# Altium project PCB_Project.PrjPcb
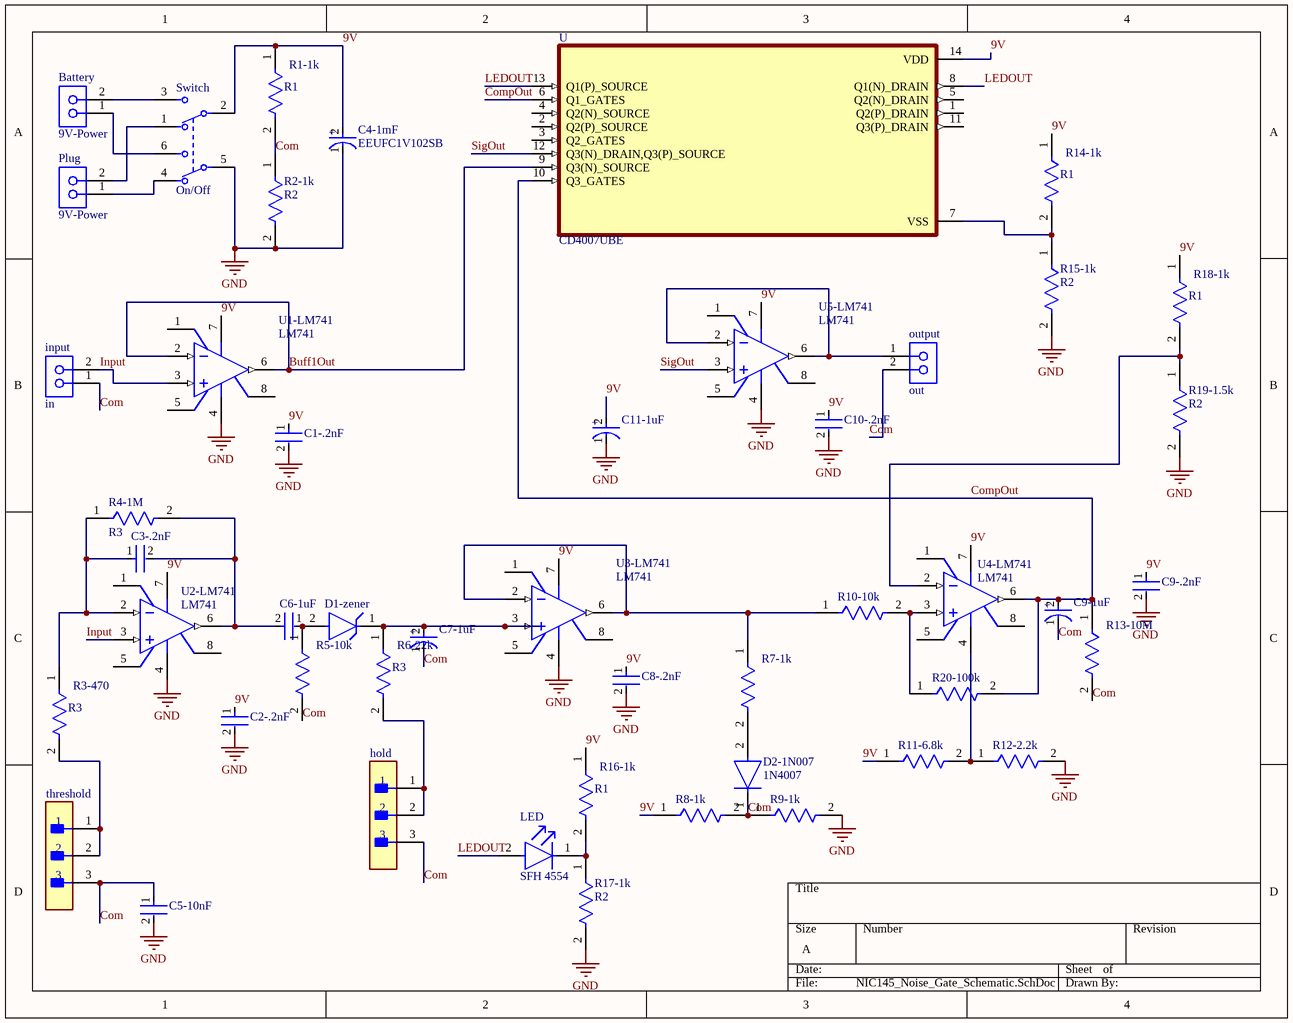
[diagram p0: NIC145_Noise_Gate_Schematic.SchDoc]
1 sheet, 48 parts. Net scope: global (net labels, ports and power ports of the same name join across sheets).
Board file: Noise_Gate_PCB.PcbDoc

## Sheet NIC145_Noise_Gate_Schematic.SchDoc
size A; SheetNumber: 1; SheetTotal: 1

### Parts
Battery  9V-Power  [SMTC-SSW-102-02-X-S]
C1-.2nF  (no value)  [FP-565R30GASS33-MFG]
C2-.2nF  (no value)  [FP-565R30GASS33-MFG]
C3-.2nF  (no value)  [FP-565R30GASS33-MFG]
C4-1mF  EEUFC1V102SB  [FP-RAD-TH-D_16_0_5-L_20_2-MFG]
C5-10nF  ECWF4754JL  [FP-ECWF4754JL-MFG]  (value not drawn)
C6-1uF  PHE844RR7100MR06L2  [FP-PHE844RR7100MR06L2-MFG]  (value not drawn)
C7-1uF  ECA-2CHG010I  [FP-ECA-2CHG010I-MFG]  (value not drawn)
C8-.2nF  (no value)  [FP-565R30GASS33-MFG]
C9-1uF  ECA-2CHG010I  [FP-ECA-2CHG010I-MFG]  (value not drawn)
C9-.2nF  (no value)  [FP-565R30GASS33-MFG]
C10-.2nF  (no value)  [FP-565R30GASS33-MFG]
C11-1uF  ECA-2CHG010I  [FP-ECA-2CHG010I-MFG]  (value not drawn)
D1-zener  1N5242BTR  [FP-017AG-MFG]  (value not drawn)
D2-1N007  1N4007  [FP-1N4007-MFG]
hold  (no value)  [FP-641966-1-MFG]
input  in  [SMTC-SSW-102-02-X-S]
LED  SFH 4554  [FP-SFH_4554-MFG]
output  out  [SMTC-SSW-102-02-X-S]
Plug  9V-Power  [SMTC-SSW-102-02-X-S]
R1-1k  R1  [FP-MRS25-MFG]
R2-1k  R2  [FP-MRS25-MFG]
R3-470  R3  [FP-MRS25-MFG]
R4-1M  R3  [FP-MRS25-MFG]
R5-10k  R3  [FP-MRS25-MFG]  (value not drawn)
R6-22k  R3  [FP-MRS25-MFG]
R7-1k  R3  [FP-MRS25-MFG]  (value not drawn)
R8-1k  R1  [FP-MRS25-MFG]  (value not drawn)
R9-1k  R2  [FP-MRS25-MFG]  (value not drawn)
R10-10k  R2  [FP-MRS25-MFG]  (value not drawn)
R11-6.8k  R1  [FP-MRS25-MFG]  (value not drawn)
R12-2.2k  R2  [FP-MRS25-MFG]  (value not drawn)
R13-10M  R3  [FP-MRS25-MFG]  (value not drawn)
R14-1k  R1  [FP-MRS25-MFG]
R15-1k  R2  [FP-MRS25-MFG]
R16-1k  R1  [FP-MRS25-MFG]
R17-1k  R2  [FP-MRS25-MFG]
R18-1k  R1  [FP-MRS25-MFG]
R19-1.5k  R2  [FP-MRS25-MFG]
R20-100k  R2  [FP-MRS25-MFG]  (value not drawn)
Switch  On/Off  [FP-100DP1T2B3M2QEH-MFG]
threshold  (no value)  [FP-641966-1-MFG]
U  CD4007UBE  [DIP794W45P254L1969H508Q14]
U1-LM741  LM741  [P0008A]
U2-LM741  LM741  [P0008A]
U3-LM741  LM741  [P0008A]
U4-LM741  LM741  [P0008A]
U5-LM741  LM741  [P0008A]

### Nets
GND: C1-.2nF.2 C2-.2nF.2 C4-1mF.1(C) C5-10nF.2 C8-.2nF.2 C9-.2nF.2 C10-.2nF.2 C11-1uF.1(C) R2-1k.2 R9-1k.2 R12-2.2k.2 R15-1k.2 R17-1k.2 R19-1.5k.2 Switch.5 U1-LM741.4(V-) U2-LM741.4(V-) U3-LM741.4(V-) U5-LM741.4(V-)
9V: C1-.2nF.1 C2-.2nF.1 C4-1mF.2(A) C8-.2nF.1 C9-.2nF.1 C10-.2nF.1 C11-1uF.2(A) R1-1k.1 R8-1k.1 R11-6.8k.1 R14-1k.1 R16-1k.1 R18-1k.1 Switch.2 U.14(VDD) U1-LM741.7(V+) U2-LM741.7(V+) U3-LM741.7(V+) U4-LM741.7(V+) U5-LM741.7(V+)
Buff1Out: U.9(Q3(N)_SOURCE) U1-LM741.2(IN-) U1-LM741.6(OUT)
Com: C5-10nF.1 C7-1uF.1(C) C9-1uF.1(C) D2-1N007.1(C) hold.3 input.1 output.2 R1-1k.2 R2-1k.1 R5-10k.2 R8-1k.2 R9-1k.1 R13-10M.2 threshold.3
CompOut: C9-1uF.2(A) R13-10M.1 R20-100k.2 U.6(Q1_GATES) U.10(Q3_GATES) U4-LM741.6(OUT)
Input: input.2 U1-LM741.3(IN+) U2-LM741.3(IN+)
LEDOUT: LED.2(A) U.8(Q1(N)_DRAIN) U.13(Q1(P)_SOURCE)
SigOut: U.12(Q3(N)_DRAIN,Q3(P)_SOURCE) U5-LM741.3(IN+)
NetBattery_1: Battery.1 Switch.6
NetBattery_2: Battery.2 Switch.3
NetC3-.2nF_1: C3-.2nF.1 R3-470.1 R4-1M.1 U2-LM741.2(IN-)
NetC3-.2nF_2: C3-.2nF.2 C6-1uF.2 R4-1M.2 U2-LM741.6(OUT)
NetC6-1uF_1: C6-1uF.1 D1-zener.2(A) R5-10k.1
NetC7-1uF_2: C7-1uF.2(A) D1-zener.1(C) R6-22k.1 U3-LM741.3(IN+)
NetD2-1N007_2: D2-1N007.2(A) R7-1k.2
Nethold_1: hold.1 hold.2 R6-22k.2
NetLED_1: LED.1(C) R16-1k.2 R17-1k.1
Netoutput_1: output.1 U5-LM741.2(IN-) U5-LM741.6(OUT)
NetPlug_1: Plug.1 Switch.4
NetPlug_2: Plug.2 Switch.1
NetR3-470_2: R3-470.2 threshold.1 threshold.2
NetR7-1k_1: R7-1k.1 R10-10k.1 U3-LM741.2(IN-) U3-LM741.6(OUT)
NetR10-10k_2: R10-10k.2 R20-100k.1 U4-LM741.3(IN+)
NetR11-6.8k_2: R11-6.8k.2 R12-2.2k.1 U4-LM741.4(V-)
NetR14-1k_2: R14-1k.2 R15-1k.1 U.7(VSS)
NetR18-1k_2: R18-1k.2 R19-1.5k.1 U4-LM741.2(IN-)

Not connected (* = marked no-connect by the designer): U 1(Q2(P)_DRAIN) 2(Q2(P)_SOURCE) 3(Q2_GATES) 4(Q2(N)_SOURCE) 5(Q2(N)_DRAIN) 11(Q3(P)_DRAIN); U1-LM741 1(OFS_NULL) 5(OFS_NULL) 8(NC); U2-LM741 1(OFS_NULL) 5(OFS_NULL) 8(NC); U3-LM741 1(OFS_NULL) 5(OFS_NULL) 8(NC); U4-LM741 1(OFS_NULL) 5(OFS_NULL) 8(NC); U5-LM741 1(OFS_NULL) 5(OFS_NULL) 8(NC)

### Notes on the sheet
- (in symbol CMP-05427-002176-1) +
- (in symbol CMP-05427-002178-1) +

### Library data of the parts
Battery input output Plug = CMP-1023-00323-1: SQ Post Socket, Through-hole, Vertical, -55 to 105 degC, 2.54 mm Pitch, 2-Pin, Female, RoHS; Manufacturer: Samtec; PartNumber: SSW-102-02-T-S; Pitch: 2.54 mm; ComponentLink3Description: Package Specification; ComponentLink2Description: Datasheet; ComponentLink1Description: Manufacturer URL; PackageVersion: CA, 6/1987; DatasheetVersion: F-214; PackageDescription: Assembly, Socket Strip .016 X .031 Tail; ComponentLink2URL: http://www.samtec.com/documents/webfiles/pdf/SSW_TH.PDF; RoHS: True; ComponentLink3URL: http://www.samtec.com/documents/webfiles/cpdf/SSW-1XX-XX-XXX-X-XX-XXX-XX-MKT.pdf; ComponentLink1URL: http://www.samtec.com; PackageReference: SSW-102-02-X-S; Mounting Technology: Through-hole; Orientation: Vertical; Temperature Range: -55 to 105 degC
C1-.2nF C2-.2nF C3-.2nF C8-.2nF C9-.2nF C10-.2nF = CMP-00030-41968055-1: 565R30GASS33 33nF 3 kV dc Ceramic Single Layer Capacitor; Z5U Dielectric Radial 565R Series; Voltage: 3kV; Tolerance: 20%; Lead Diameter: 640µm; Diameter: 22.9mm; Lead Free: Lead Free; Material: Ceramic; Schedule B: 8532230060; Depth: 6.1mm; Mount: Radial; Max Operating Temperature: 105°C; Capacitance: 33nF; Composition: Ceramic; RoHS: Compliant; Min Operating Temperature: -25°C; Dielectric: Z5U; NexarPartId: 41968055; Height: 22.9mm; Voltage Rating: 3kV; Lead Pitch: 9.52mm; Termination: Radial; Packaging: Bulk; Case/Package: Radial; Voltage Rating (DC): 3kV
C4-1mF = CMP-05427-002178-1: Aluminum Electrolytic Capacitors (Radial Lead Type) AEC-Q200 Qualified 1000uF ±20% 35V; Polarity: Polar; Life (Hours): 5000Hour; ESR (Equivalent Series Resistance): 29mR; Ripple Current: 2.205A; Capacitance: 1mF; Lead Diameter: 0.8mm; Radiation Hardening: No; Lead Pitch: 7.5mm; Package Quantity: 250; Voltage Rating: 35V; Voltage Rating (DC): 35V; Ratings: AEC-Q200; Impedance: 29mR; Length: 20mm; Mount: Through Hole; Series: FC; Case/Package: Radial; Min Operating Temperature: -55°C; RoHS Compliant: Yes; Height: 20mm; Packaging: Tape and Reel; Contact Plating: Tin; Max Operating Temperature: 105°C; Height - Seated (Max): 1.063inch; Tolerance: 20%; Diameter: 16mm; Termination: Radial
C5-10nF = CMP-05434-000002-1: CAP FILM 0.75UF 5% 400VDC RADIAL; Manufacturer: Panasonic Electronic Components; Standoff Height: 1.5mm; Material: Plastic Film; Voltage Rating: 400V; Device Class L1: Passive Components; Device Class L2: Capacitors; ComponentLink2Description: Datasheet; Ipc Land Pattern Name: CAPAD1750W100L2050D1230; ComponentLink2URL: https://industrial.panasonic.com/cdbs/www-data/pdf/RDI0000/ABD0000C245.pdf; Temperature: -40°C to +105°C; Device Class L3: Film Capacitors; Temperature Range Low: -40°C; Value: 0.75uF; Lead Free: Yes; Tolerance: 5%; Capacitance: 0.75uF; Height: 20.6mm; Manufacturer Part Number: ECWF4754JL; RoHS: TRUE; Category: Cap; Digikey Description: CAP FILM 0.75UF 5% 400VDC RADIAL; Temperature Range High: +105°C; Automotive: No; Package: ECWF4754JL; Octopart: https://octopart.com/ecw-f4754jl-panasonic-39488642
C6-1uF = CMP-03022-000020-1: CAP FILM 1UF 20% 1KVDC RADIAL; Dielectric Material: PP; Lead Diameter: 1mm; Voltage Rating (AC): 440V; Voltage Rating (DC): 1kV; Series: PHE844; RoHS Compliant: Yes; Width: 0.61inch; Length: 41mm; Mount: Through Hole; Case/Package: Radial; Lead Pitch: 37.5mm; REACH SVHC: No SVHC; Height - Seated (Max): 1.024inch; Capacitance: 1uF; Depth: 15mm; Dielectric: PP; Tolerance: 20%; Termination: Radial; Height: 21mm; Packaging: Tray; Max Operating Temperature: 105°C; Construction: RADIAL; Min Operating Temperature: -40°C; Radiation Hardening: No
C7-1uF C9-1uF C11-1uF = CMP-05427-002176-1: CAP ALUM 1UF 20% 160V RADIAL; Lead/Base Style: Straight; Ripple Current: 17mA; Life (Hours): 2000Hour; Voltage Rating (DC): 160V; Max Operating Temperature: 105°C; Radiation Hardening: No; Min Operating Temperature: -25°C; Packaging: Ammo Pack; Series: NHG; Capacitance: 1uF; Height - Seated (Max): 0.48inch; Lead Pitch: 2.5mm; Diameter: 6.3mm; Length: 11.2mm; Package Quantity: 2000; Termination: Radial; RoHS Compliant: Yes; Voltage Rating: 160V; Tolerance: 20%; Height: 11.2mm; Case/Package: Radial; Mount: Through Hole
D1-zener = CMP-00278-84408833-1: 1N5242BTR 1N5242 Series 500 mW 12 V 200 mA Through Hole Zener Diode - DO-35; Manufacturer Lifecycle Status: ACTIVE; Working Voltage: 12V; Impedance: 30Ω; Max Power Dissipation: 500mW; ESD Protection: No; Max Reverse Leakage Current: 100nA; Zener Current: 20mA; Forward Voltage: 1.2V; Tolerance: 5%; Element Configuration: Single; Peak Reverse Current: 1µA; Packaging: Cut Tape (CT); Zener Voltage: 12V; Voltage Rating (DC): 12V; Schedule B: 8541100050, 8541100050; Power Rating: 500mW; Radiation Hardening: No; Width: 6.35mm; Length: 4.56mm; Number of Pins: 2; Power Dissipation: 500mW; NexarPartId: 84408833; Lead Free: Lead Free; Lifecycle Status: Production; Contact Plating: Tin; Min Operating Temperature: -65°C; Max Operating Temperature: 200°C; Mount: Through Hole; RoHS: Compliant; Height: 6.35mm; Voltage Tolerance: 5%; Test Current: 20mA; Weight: 80g; REACH SVHC: No SVHC; Diameter: 1.91mm
D2-1N007 = CMP-123542-000001-1: Rectifier diode 1000 V 1 A DO-41, ,; Manufacturer: Diotec; Max Surge Forward Current: 27A; Forward Current: 1A; Max Junction Temp: +175°C; Reverse Voltage: 1000V; Value: 15pF; Peak Reverse Current: 5uA; Category: Diode; Temperature Range Low: -50°C; Automotive: No; Temperature: -50°C to +175°C; Lead Free: Yes; ComponentLink2Description: Datasheet; Max Repetitive Reverse Voltage: 1000V; ComponentLink2URL: https://datasheet.octopart.com/1N4007-Diotec-datasheet-62346875.pdf; Manufacturer Part Number: 1N4007; Device Class L3: Rectifier Diodes; Height: 2.8mm; Octopart: https://octopart.com/1n4007-diotec-4040411; Package: 1N4007; Temperature Range High: +175°C; Device Class L1: Discrete Semiconductors; Device Class L2: Diodes; RoHS: TRUE; Capacitance: 15pF; Ipc Land Pattern Name: DIOAD888W100L520D280
hold threshold = CMP-03369-000088-1: CONN HEADER VERT 3POS 6.35MM; Manufacturer Part Number: 641966-1; Manufacturer: TE; Conn Orientation: Vertical; Voltage Rating: 600V; Standoff Height: 0.63mm; Current Rating: 19A; Number Of Contacts: 3; Conn Gender: Male; ComponentLink2URL: https://www.te.com/usa-en/product-641966-1.html?te_bu=Cor&te_type=other&te_campaign=oct_glo_cor-oct-global-oth-prtnr-fy19-oct-octo-buy-bom_sma-298_2&elqCampaignId=35216; Octopart: https://octopart.com/641966-1-te+connectivity-46507674; Footprint Url: https://www.te.com/commerce/DocumentDelivery/DDEController?Action=showdoc&DocId=Customer+Drawing%7F641966%7FP1%7Fpdf%7FEnglish%7FENG_CD_641966_P1.pdf%7F641966-1; Category: Conn; Contact Material: Tin; Lead Free: Yes; ComponentLink2Description: Datasheet; Package: 641966-1; Height: 14.99mm; RoHS: TRUE; Mouser Description: Pin & Socket Connectors 3POS VERT MATE-N-LOK; Temperature: -55°C to +105°C; Temperature Range Low: -55°C; Device Class L1: Connectors; Device Class L3: unset; Digikey Description: CONN HEADER VERT 3POS 6.35MM; Pitch: 6.35mm; Device Class L2: Headers and Wire Housings; Temperature Range High: +105°C; Automotive: No
LED = CMP-62016-000002-1: EMITTER IR 850NM; Manufacturer: Osram Opto; Forward Voltage: 1.7V; Viewing Angle: 20°; Forward Current: 100mA; Led Orientation: Straight; Power Dissipation: 200mW; Peak Emmision Wavelength: 860nm; Reverse Voltage: 5V; Manufacturer Part Number: SFH 4554; Automotive: No; Category: Diode; Octopart: https://octopart.com/sfh+4554-osram+opto-55819455; ComponentLink2URL: https://forum.upverter.com/uploads/short-url/9WLvpCRBrQtL1CWwnUt39ojzKI8.pdf; Device Class L1: Optoelectronics; Device Class L3: unset; Temperature Range Low: -40°C; Mouser Description: Infrared Emitter 850nm 550mW/sr Circular Top Mount 2-Pin T-1 3/4; Lead Free: Yes; ComponentLink2Description: Datasheet; Temperature: -40°C to +100°C; RoHS: TRUE; Temperature Range High: +100°C; Colour: Infrared; Digikey Description: EMITTER IR 850NM; Device Class L2: LEDs; Package: SFH_4554
R1-1k R2-1k R3-470 R4-1M R5-10k R6-22k R7-1k R8-1k R9-1k R10-10k R11-6.8k R12-2.2k R13-10M R14-1k R15-1k R16-1k R17-1k R18-1k R19-1.5k R20-100k = CMP-02408-000051-1: RES 1K OHM 0.6W 1% AXIAL; Power Rating: 600mW; Lead Diameter: 0.6mm; Voltage Rating (DC): 350V; Resistance: 1kR; Temperature Coefficient: 50ppm/°C; Width: 2.5mm; Military Standard: Not; Package Quantity: 5000; Radiation Hardening: No; Case/Package: Axial; Resistance Tolerance: 1%; Resistor Type: Metal Film; Contact Plating: Tin; Length: 6.5mm; Lead Free: Lead Free; RoHS Compliant: Yes; Mount: Through Hole; Number of Pins: 2; Technology: THIN FILM; Voltage Rating: 350V; Min Operating Temperature: -55°C; Weight: 0.00776oz; Diameter: 2.5mm; Construction: Cylindrical; Series: MRS25; Tolerance: 1%; Packaging: Tape and Reel; Max Operating Temperature: 155°C; Max Power Dissipation: 600mW; Number of Terminations: 2; Termination: Axial
Switch = CMP-17880-000002-1: SWITCH TOGGLE NON ILLUMINATED; Manufacturer: E-Switch; Manufacturer Part Number: 100DP1T2B3M2QEH; Contact Current Rating: 5A; Electromechanical Life: 40000Cycles; Contact Resistance: 10mΩ; Voltage Rating Ac: 120V; Throw Configuration: DPDT; Voltage Rating Dc: 28V; ComponentLink2Description: Datasheet; Height: 23.6mm; Temperature Range Low: -30°C; RoHS: TRUE; Package: 0; Category: Switch; Mouser Description: Toggle Switches 5A 120VAC/28VDC On-None-On PC Mnt; ComponentLink2URL: http://spec_sheets.e-switch.com/specs/ST121094.pdf; Lead Free: Yes; Device Class L2: Switches; Digikey Description: SWITCH TOGGLE NON ILLUMINATED; Temperature: -30°C to +85°C; Footprint Url: http://spec_sheets.e-switch.com/specs/ST121094.pdf; Automotive: No; Temperature Range High: +85°C; Device Class L3: Toggle Switches; Octopart: https://octopart.com/100dp1t2b3m2qeh-e-switch-7054946; Mount: Through Hole; Device Class L1: Electromechanical
U = CD4007UBE: CMOS dual complementary pair plus inverter 14-PDIP -55 to 125; MF: Texas Instruments; Value: *; Availability: Unavailable; Price: None; Package: PDIP-14 Texas Instruments; Texas_Instruments-Purchase-URL: https://snapeda.com/shop?store=Texas+Instruments&id=2816072; MP: CD4007UBE; SnapEDA_Link: https://www.snapeda.com/parts/CD4007UBE/Texas%20Instruments/view-part/2816072/?ref=snap
U1-LM741 U2-LM741 U3-LM741 U4-LM741 U5-LM741 = CMP-0055-00162-3: Operational Amplifier, 8-pin MDIP, Pb-Free; Manufacturer: Texas Instruments; PackageTopMarking: NSUZXYTTE#*LM*741CN; PowerWise: N; CompType: Amplifiers; ComponentLink1Description: Datasheet URL; ComponentLink1URL: http://www.ti.com/general/docs/lit/getliterature.tsp?genericPartNumber=LM741&fileType=pdf; PackageDescription: MDIP, .365 x .250 x .130in, 8 Lead, .100in Pitch; RoHS: Y; PinCount: 8; Code_JEDEC: MS-001-BA; Package Reference: P0008A